# Altium schematic sheet Sheet1_1.SchDoc
size A
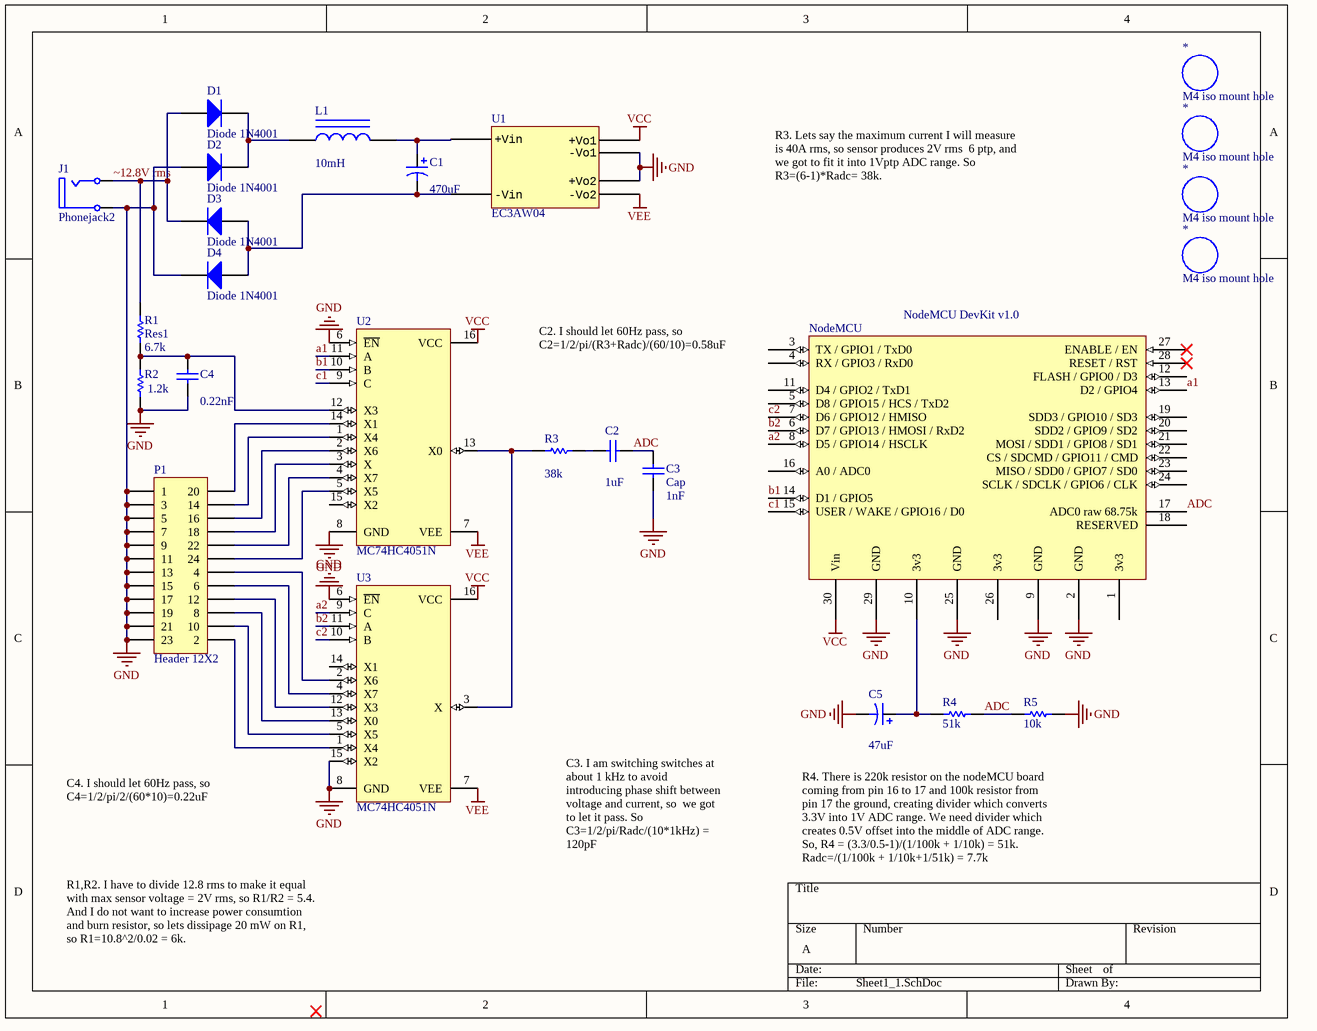
[diagram p0: Sheet1_1.SchDoc]

## Parts
(Parts that share a designator on the sheet are numbered #1, #2 ... from top to bottom, then left to right.)
*#1  M4 iso mount hole  [M4 hole]  (no BOM)
*#2  M4 iso mount hole  [M4 hole]  (no BOM)
*#3  M4 iso mount hole  [M4 hole]  (no BOM)
*#4  M4 iso mount hole  [M4 hole]  (no BOM)
C1  value 470uF  [CAPPR5-12.5x25]  (hidden comment: Cap Pol1)
C2  value 1uF  [RAD-0.3]  (hidden comment: Cap)
C3  Cap  value 1nF  [RAD-0.3]
C4  value 0.22nF  [RAD-0.3]  (hidden comment: Cap)
C5  value 47uF  [CAPPR2.5-6.3x6.8/H.9]  (hidden comment: Cap Pol1)
D1  Diode 1N4001  [DO-41]
D2  Diode 1N4001  [DO-41]
D3  Diode 1N4001  [DO-41]
D4  Diode 1N4001  [DO-41]
J1  Phonejack2  [Power jack 6x2mm]
L1  value 10mH  [Radial Vert Cylinder 10x19-6mm]  (hidden comment: Inductor Iron)
NodeMCU  NodeMCU DevKit v1.0  [NodeMCU DevKit v1.0 - Inside Labels]
P1  Header 12X2  [HDR2X12]
R1  Res1  value 6.7k  [AXIAL-0.3]
R2  value 1.2k  [AXIAL-0.3]  (hidden comment: Res1)
R3  value 38k  [AXIAL-0.3]  (hidden comment: Res1)
R4  value 51k  [AXIAL-0.3]  (hidden comment: Res1)
R5  value 10k  [AXIAL-0.3]  (hidden comment: Res1)
U1  EC3AW04  [EC3AW]
U2  MC74HC4051N  [648-08]
U3  MC74HC4051N  [648-08]

## Nets
GND: C3.1 C4.1 C5.2 D2.1(A) D4.2(K) J1.5(S) NodeMCU.2(GND) NodeMCU.9(GND) NodeMCU.25(GND) NodeMCU.29(GND) P1.1 P1.3 P1.5 P1.7 P1.9 P1.11 P1.13 P1.15 P1.17 P1.19 P1.21 P1.23 R2.2 R5.1 U1.3(+Vo2) U1.10(-Vo1) U2.6(~{EN}) U2.8(GND) U3.6(~{EN}) U3.8(GND) U3.15(X2)
VCC: NodeMCU.30(Vin) U1.11(+Vo1) U2.16(VCC) U3.16(VCC)
VEE: U1.2(-Vo2) U2.7(VEE) U3.7(VEE)
a1: NodeMCU.13(D2_/_GPIO4) U2.11(A)
a2: NodeMCU.8(D5_/_GPIO14_/_HSCLK) U3.9(C)
ADC: C2.1 C3.2 NodeMCU.17(ADC0_raw_68.75k) R4.1 R5.2
b1: NodeMCU.14(D1_/_GPIO5) U2.10(B)
b2: NodeMCU.6(D7_/_GPIO13_/_HMOSI_/_RxD2) U3.11(A)
c1: NodeMCU.15(USER_/_WAKE_/_GPIO16_/_D0) U2.9(C)
c2: NodeMCU.7(D6_/_GPIO12_/_HMISO) U3.10(B)
~12.8V rms: D1.1(A) D3.2(K) J1.1(T) R1.2
NetC1_1: C1.1 L1.2 U1.1(+Vin)
NetC1_2: C1.2 D3.1(A) D4.1(A) U1.12(-Vin)
NetC2_2: C2.2 R3.2
NetC4_2: C4.2 R1.1 R2.1 U2.12(X3)
NetC5_1: C5.1 NodeMCU.10(3v3) R4.2
NetD1_2: D1.2(K) D2.2(K) L1.1
NetP1_2: P1.2 U3.1(X4)
NetP1_4: P1.4 U3.2(X6)
NetP1_6: P1.6 U3.4(X7)
NetP1_8: P1.8 U3.13(X0)
NetP1_10: P1.10 U3.5(X5)
NetP1_12: P1.12 U3.12(X3)
NetP1_14: P1.14 U2.1(X4)
NetP1_16: P1.16 U2.2(X6)
NetP1_18: P1.18 U2.3(X)
NetP1_20: P1.20 U2.14(X1)
NetP1_22: P1.22 U2.4(X7)
NetP1_24: P1.24 U2.5(X5)
NetR3_1: R3.1 U2.13(X0) U3.3(X)

Not connected (* = marked no-connect by the designer): NodeMCU 1(3v3) 3(TX_/_GPIO1_/_TxD0) 4(RX_/_GPIO3_/_RxD0) 5(D8_/_GPIO15_/_HCS_/_TxD2) 11(D4_/_GPIO2_/_TxD1) 12(FLASH_/_GPIO0_/_D3) 16(A0_/_ADC0) 18(RESERVED) 19(SDD3_/_GPIO10_/_SD3) 20(SDD2_/_GPIO9_/_SD2) 21(MOSI_/_SDD1_/_GPIO8_/_SD1) 22(CS_/_SDCMD_/_GPIO11_/_CMD) 23(MISO_/_SDD0_/_GPIO7_/_SD0) 24(SCLK_/_SDCLK_/_GPIO6_/_CLK) 26(3v3) 27(ENABLE_/_EN)* 28(RESET_/_RST)*; U2 15(X2); U3 14(X1)

## Notes on the sheet
- R3. Lets say the maximum current I will measure is 40A rms, so sensor produces 2V rms  6 ptp, and we got to fit it into 1Vptp ADC range. So R3=(6-1)*Radc= 38k.
- C2. I should let 60Hz pass, so C2=1/2/pi/(R3+Radc)/(60/10)=0.58uF
- C4. I should let 60Hz pass, so C4=1/2/pi/2/(60*10)=0.22uF
- C3. I am switching switches at about 1 kHz to avoid introducing phase shift between voltage and current, so  we got to let it pass. So C3=1/2/pi/Radc/(10*1kHz) = 120pF
- R4. There is 220k resistor on the nodeMCU board coming from pin 16 to 17 and 100k resistor from pin 17 the ground, creating divider which converts 3.3V into 1V ADC range. We need divider which creates 0.5V offset into the middle of ADC range. So, R4 = (3.3/0.5-1)/(1/100k + 1/10k) = 51k. Radc=/(1/100k + 1/10k+1/51k) = 7.7k
- R1,R2. I have to divide 12.8 rms to make it equal with max sensor voltage = 2V rms, so R1/R2 = 5.4.
  And I do not want to increase power consumtion and burn resistor, so lets dissipage 20 mW on R1, so R1=10.8^2/0.02 = 6k.

## Library data of the parts
C1 C5 = Cap Pol1: Polarized Capacitor (Radial); Published: 8-Jun-2000; LatestRevisionDate: 17-Jul-2002; LatestRevisionNote: Re-released for DXP Platform.; PackageReference: RB7.6-15; Publisher: Altium Limited; PackageDescription: Polarized Capacitor (Radial); 2 Leads
C2-C4 = Cap: Capacitor; Published: 8-Jun-2000; LatestRevisionDate: 17-Jul-2002; LatestRevisionNote: Re-released for DXP Platform.; PackageReference: RAD-0.3; Publisher: Altium Limited; PackageDescription: Radial Cap, Thru-Hole; 2 Leads; 0.3 in Pin Spacing
D1-D4 = Diode 1N4001: 1 Amp General Purpose Rectifier; Published: 8-Jun-2000; LatestRevisionDate: 17-Jul-2002; LatestRevisionNote: Re-released for DXP Platform.; DatasheetVersion: 1998; PackageVersion: Aug-1999; PackageReference: DO-41; Publisher: Altium Limited; PackageDescription: Diode, Axial; Body 5.2 x 2.7 mm (LxDia. max), Lead Dia. 0.86 mm (max); Code_JEDEC: DO-204-AL; ComponentLink1Description: Manufacturer Link; ComponentLink1URL: http://www.fairchildsemi.com/; ComponentLink2Description: Datasheet; ComponentLink2URL: http://www.fairchildsemi.com/ds/1N%2F1N4001.pdf
J1 = Phonejack2: Jack Socket, 1/4" [6.5mm], Thru-Hole, Vertical, 2-Conductor Open Circuit; pin to pad: 1>T 5>S; PackageDocument: 2003; PCB_Layout: Complies with manufacturer's recommendation.; DrillAndSlotSize: Corresponds to nominal value.; LatestRevisionDate: 15-Jul-2004; LatestRevisionNote: Component Replaced.; DatasheetDocument: 2003; PackageReference: S1VS_SNS; Publisher: Altium Limited; ComponentLink1Description: Manufacturer Link; ComponentLink1URL: http://www.cliffuk.co.uk/
L1 = Inductor Iron: Magnetic-Core Inductor; Published: 24-Mar-1999; LatestRevisionDate: 17-Jul-2002; LatestRevisionNote: Re-released for DXP Platform.; PackageReference: AXIAL-0.9; Publisher: Altium Limited; PackageDescription: Axial Device, Thru-Hole; 2 Leads; 0.9 in Pin Spacing
P1 = Header 12X2: Header, 12-Pin, Dual row; LatestRevisionDate: 17-Jul-2002; LatestRevisionNote: Re-released for DXP Platform.; Publisher: Altium Limited
R1-R5 = Res1: Resistor; Published: 8-Jun-2000; LatestRevisionDate: 17-Jul-2002; LatestRevisionNote: Re-released for DXP Platform.; PackageReference: AXIAL-0.3; Publisher: Altium Limited; PackageDescription: Axial Device, Thru-Hole; 2 Leads; 0.3 in Pin Spacing
U1 = EC3AW04: Input Voltage: 9 V to 36 V; Isolation Voltage: 500 V; Number of Outputs: 2 Output; Output Power: 3 W; Brand: Cincon; Output Current-Channel 1: 300 mA; Output Voltage-Channel 1: 5 V; Output Voltage-Channel 2: - 5 V; Manufacturer PN: EC3AW04; Supplier 1: Mouser; Supplier Part Number 1: 418-EC3AW04; Manufacturer Part Number: EC3AW04; RoHS: RoHS Compliant; Category: Isolated DC/DC Converters; Stock 1: 17; Pricing 1: 1=13.19, 10=12.51, 50=12.27, 100=12.10, 500=10.67, 1000=9.96 (USD); Product: Isolated; Series: EC3AW; Mounting Style: Through Hole; Output Current-Channel 2: 300 mA; Standard Pack Qty: 1; RoHS - Mouser: Y; Minimum Order Quantity: 1; Reeling: False; ComponentLink1URL: http://www.mouser.com/ds/2/75/EC3AW-V14-541900.pdf; ComponentLink1Description: http://www.mouser.com/ds/2/75/EC3AW-V14-541900.pdf
U2 U3 = MC74HC4051N: 8-Channel Analog Multiplexer/Demultiplexer; Published: 15-Apr-2002; DatasheetVersion: 1995; PackageVersion: Apr-2000; PackageReference: 648-08; Publisher: Altium Limited; PackageDescription: DIP; 16 Leads; Row Spacing 7.62 mm; Pitch 2.54 mm; Code_JEDEC: MS-001-BB; ComponentLink1Description: Manufacturer Link; ComponentLink1URL: http://www.onsemi.com/; ComponentLink2Description: Datasheet; ComponentLink2URL: http://www.onsemi.com/pub/Collateral/MC74HC4051-D.PDF